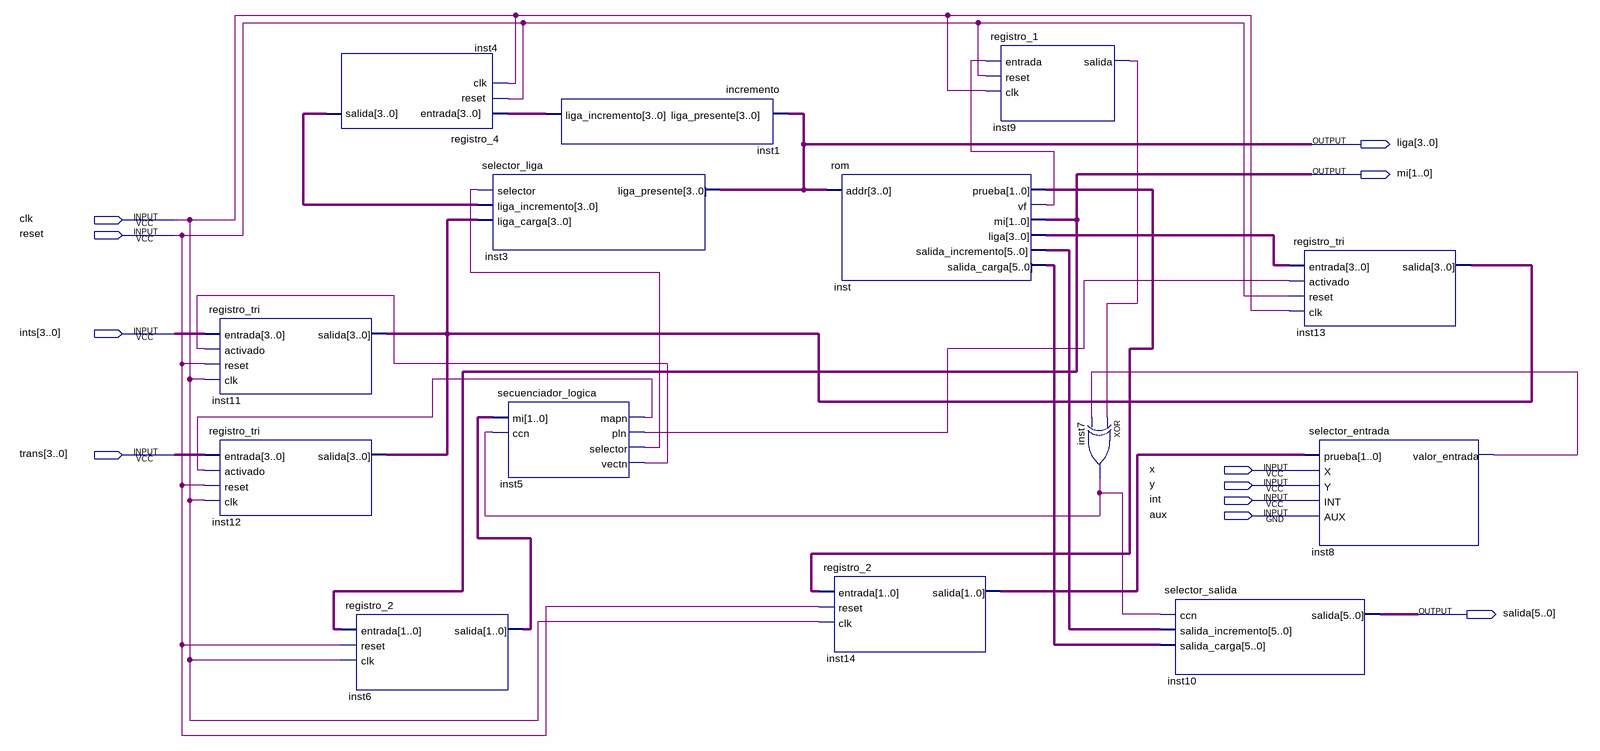
[diagram p0: schematic sheet]
// Quartus schematic practica_6.bdf as structural Verilog: 14 symbols, 11 pins
module practica_6 (
  input  clk,
  input  reset,
  input  [3:0] ints,
  input  [3:0] trans,
  input  x,
  input  y,
  input  \int ,
  input  aux,
  output [3:0] liga,
  output [1:0] mi,
  output [5:0] salida
);

  wire inst5_mapn, inst5_pln, inst5_selector, inst5_vectn, inst7_out, inst8_valor_entrada, inst9_salida,
       inst_vf;
  wire [1:0] inst6_salida, inst14_salida, inst_prueba;
  wire [3:0] inst1_liga_incremento, inst4_salida, inst11_salida, inst_liga;
  wire [5:0] inst_salida_carga, inst_salida_incremento;

  registro_tri inst11 (.entrada(ints), .activado(inst5_vectn), .reset(reset), .clk(clk), .salida(inst11_salida));
  registro_tri inst12 (.entrada(trans), .activado(inst5_mapn), .reset(reset), .clk(clk), .salida(inst11_salida));
  registro_4 inst4 (.entrada(inst1_liga_incremento), .reset(reset), .clk(clk), .salida(inst4_salida));
  registro_2 inst6 (.entrada(mi), .reset(reset), .clk(clk), .salida(inst6_salida));
  selector_liga inst3 (
    .selector(inst5_selector), .liga_incremento(inst4_salida), .liga_carga(inst11_salida),
    .liga_presente(liga));
  secuenciador_logica inst5 (
    .mi(inst6_salida), .ccn(inst7_out), .mapn(inst5_mapn), .pln(inst5_pln), .selector(inst5_selector),
    .vectn(inst5_vectn));
  incremento inst1 (.liga_presente(liga), .liga_incremento(inst1_liga_incremento));
  rom inst (
    .addr(liga), .prueba(inst_prueba), .vf(inst_vf), .mi(mi), .liga(inst_liga),
    .salida_incremento(inst_salida_incremento), .salida_carga(inst_salida_carga));
  registro_2 inst14 (.entrada(inst_prueba), .reset(reset), .clk(clk), .salida(inst14_salida));
  registro_1 inst9 (.entrada(inst_vf), .reset(reset), .clk(clk), .salida(inst9_salida));
  xor inst7 (inst7_out, inst9_salida, inst8_valor_entrada);
  selector_salida inst10 (
    .ccn(inst7_out), .salida_incremento(inst_salida_incremento), .salida_carga(inst_salida_carga),
    .salida(salida));
  registro_tri inst13 (.entrada(inst_liga), .activado(inst5_pln), .reset(reset), .clk(clk), .salida(inst11_salida));
  selector_entrada inst8 (
    .prueba(inst14_salida), .X(x), .Y(y), .INT(\int ), .AUX(aux), .valor_entrada(inst8_valor_entrada));
endmodule
